# Altium project Circuits.PrjPcb
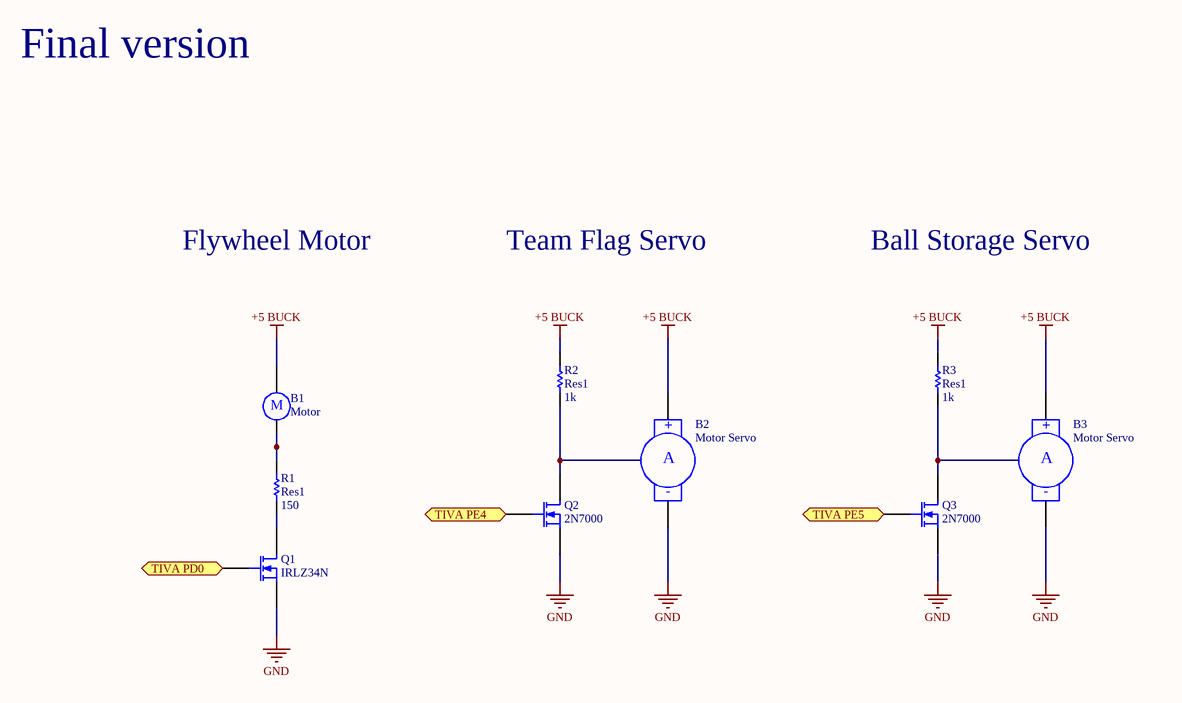
[diagram p0: Auxiliary Motors.SchDoc]
9 sheets, 120 parts. Net scope: flat (ports and power ports of the same name join across sheets).
Sheets:
  Auxiliary Motors.SchDoc
  Reloader.SchDoc
  Motor Driver.SchDoc
  Switches.SchDoc
  Misc Circuits.SchDoc
  Retroreflective Sensor.SchDoc
  Power.SchDoc
  Magnetic Sensor.SchDoc
  Beacon Sensor.SchDoc

## Sheet Auxiliary Motors.SchDoc
size A4; Organization: Altium Limited; Address1: L3, 12a Rodborough Rd; Address2: Frenchs Forest; Address3: NSW; Address4: Australia 2086

### Parts
(Parts that share a designator on the sheet are numbered #1, #2 ... from top to bottom, then left to right.)
B1#1  Motor  [RB5-10.5]
B2#1  Motor Servo  [RAD-0.4]
B3  Motor Servo  [RAD-0.4]
Q1#1  IRLZ34N  [BCY-W3/H.8]
Q2#1  2N7000  [BCY-W3/H.8]
Q3  2N7000  [BCY-W3/H.8]
R1#1  Res1  value 150  [AXIAL-0.3]
R2#1  Res1  value 1k  [AXIAL-0.3]
R3#1  Res1  value 1k  [AXIAL-0.3]

### Ports
TIVA PD0, TIVA PE4, TIVA PE5

### Nets
+5 BUCK: B1#1.1 B2#1.1(+) B3.1(+) R2#1.2 R3#1.2
GND: B2#1.2(-) B3.2(-) Q1#1.3(S) Q2#1.3(S) Q3.3(S)
NetB1#1_2: B1#1.2 R1#1.2
NetQ1#1_1: Q1#1.1(D) R1#1.1
NetQ1#1_2: Q1#1.2(G) ; port TIVA PD0
NetQ2#1_1: Q2#1.1(D) R2#1.1
NetQ2#1_2: Q2#1.2(G) ; port TIVA PE4
NetQ3_1: Q3.1(D) R3#1.1
NetQ3_2: Q3.2(G) ; port TIVA PE5

### Notes on the sheet
- Final version
- Flywheel Motor
- Team Flag Servo
- Ball Storage Servo
- Title
- Size:
- Date:
- A4
- Number:
- Time:
- Revision:
- Sheet
- of
- File:
- (in symbol Motor) M
- (in symbol Motor Servo) A

### Library data of the parts
B1#1 = Motor: Motor, General Kind; Manufacturer: Generic Components; Published: 1999
B2#1 B3 = Motor Servo: Servo Motor; Manufacturer: Generic Components; Published: 1999
Q1#1 Q2#1 Q3 = MOSFET-N: N-Channel MOSFET; Manufacturer: Generic Components; Class: Discrete; SubClass: MOSFET - Low Power; Published: 08/06/2000; Publisher: Altium Hobart Technology Centre
R1#1 R2#1 R3#1 = Res1: Resistor; Manufacturer: Generic Components; Class: Passive; Published: 08/06/2000; Publisher: Altium Hobart Technology Centre; SubClass: Resistor

## Sheet Reloader.SchDoc
size A4; Organization: Altium Limited; Address1: L3, 12a Rodborough Rd; Address2: Frenchs Forest; Address3: NSW; Address4: Australia 2086
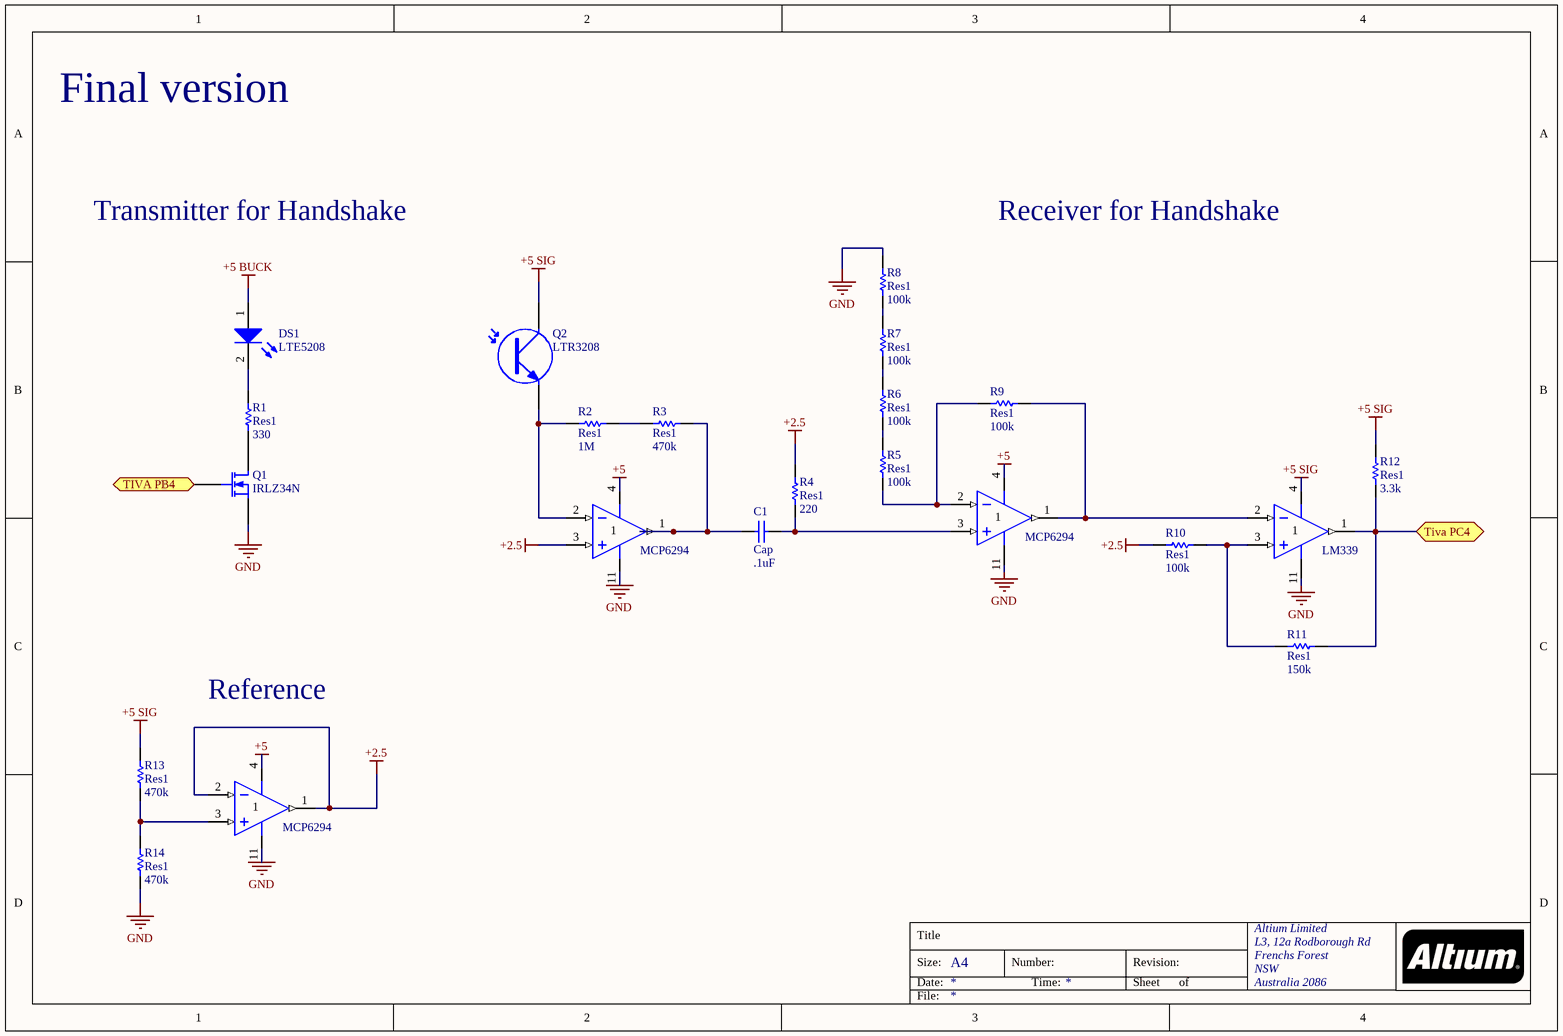
[diagram p1: Reloader.SchDoc]

### Parts
(Parts that share a designator on the sheet are numbered #1, #2 ... from top to bottom, then left to right.)
C1#1  Cap  value .1uF  [RAD-0.3]
DS1#1  LTE5208  [LED-0]
Q1#2  IRLZ34N  [BCY-W3/H.8]
Q2#2  LTR3208  [SFM-T2(3)/X1.6V]
R1#2  Res1  value 330  [AXIAL-0.3]
R2#2  Res1  value 1M  [AXIAL-0.3]
R3#2  Res1  value 470k  [AXIAL-0.3]
R4#1  Res1  value 220  [AXIAL-0.3]
R5#1  Res1  value 100k  [AXIAL-0.3]
R6#1  Res1  value 100k  [AXIAL-0.3]
R7#1  Res1  value 100k  [AXIAL-0.3]
R8#1  Res1  value 100k  [AXIAL-0.3]
R9#1  Res1  value 100k  [AXIAL-0.3]
R10#1  Res1  value 100k  [AXIAL-0.3]
R11#1  Res1  value 150k  [AXIAL-0.3]
R12#1  Res1  value 3.3k  [AXIAL-0.3]
R13#1  Res1  value 470k  [AXIAL-0.3]
R14#1  Res1  value 470k  [AXIAL-0.3]
U1#1  MCP6294  [DIP-14]  (part A of 4)
U2#1  MCP6294  [DIP-14]  (part A of 4)
U3#1  LM339  [DIP-14]  (part A of 4)
U4#1  MCP6294  [DIP-14]  (part A of 4)

### Ports
TIVA PB4, Tiva PC4

### Nets
+2.5: R4#1.2 R10#1.2 U1#1.3(IN+) U4#1.1(OUT) U4#1.2(IN-)
+5: U1#1.4(V+) U2#1.4(V+) U4#1.4(V+)
+5 BUCK: DS1#1.1(A)
+5 SIG: Q2#2.1(C) R12#1.1 R13#1.1 U3#1.4(V+)  [project net +7.2]
GND: Q1#2.3(S) R8#1.2 R14#1.2 U1#1.11(GND) U2#1.11(GND) U3#1.11(GND) U4#1.11(GND)
NetC1#1_1: C1#1.1 R3#2.2 U1#1.1(OUT)
NetC1#1_2: C1#1.2 R4#1.1 U2#1.3(IN+)
NetDS1#1_2: DS1#1.2(K) R1#2.2
NetQ1#2_1: Q1#2.1(D) R1#2.1
NetQ1#2_2: Q1#2.2(G) ; port TIVA PB4
NetQ2#2_3: Q2#2.3(E) R2#2.1 U1#1.2(IN-)
NetR2#2_2: R2#2.2 R3#2.1
NetR5#1_1: R5#1.1 R9#1.2 U2#1.2(IN-)
NetR5#1_2: R5#1.2 R6#1.1
NetR6#1_2: R6#1.2 R7#1.1
NetR7#1_2: R7#1.2 R8#1.1
NetR9#1_1: R9#1.1 U2#1.1(OUT) U3#1.2(IN-)
NetR10#1_1: R10#1.1 R11#1.2 U3#1.3(IN+)
NetR11#1_1: R11#1.1 R12#1.2 U3#1.1(OUT) ; port Tiva PC4
NetR13#1_2: R13#1.2 R14#1.1 U4#1.3(IN+)

### Notes on the sheet
- Final version
- Transmitter for Handshake
- Receiver for Handshake
- Reference
- Title
- Size:
- Date:
- A4
- Number:
- Time:
- Revision:
- Sheet
- of
- File:

### Library data of the parts
C1#1 = Cap: Capacitor; Manufacturer: Generic Components; Class: Passive; Published: 08/06/2000; Publisher: Altium Hobart Technology Centre; SubClass: Capacitor
DS1#1 = LED0: Typical INFRARED GaAs LED; Manufacturer: Generic Components; Class: Optoelectronic; Published: 08/06/2000; Publisher: Altium Hobart Technology Centre; SubClass: LED
Q1#2 = MOSFET-N: as Q1#1 on sheet Auxiliary Motors; Published: 08/06/2000; Publisher: Altium Hobart Technology Centre
Q2#2 = Photo NPN: NPN Phototransistor; Manufacturer: Generic Components; Class: Optoelectronic; Published: 1999
R1#2 R2#2 R3#2 R4#1 R5#1 R6#1 R7#1 R8#1 R9#1 R10#1 R11#1 R12#1 R13#1 R14#1 = Res1: as R1#1 on sheet Auxiliary Motors; Published: 08/06/2000; Publisher: Altium Hobart Technology Centre; SubClass: Resistor
U1#1 U2#1 U3#1 U4#1 = LM324AJ: Low-Power Quad Operational Amplifier; Manufacturer: National Semiconductor; Published: 15/04/2002; Publisher: Altium Hobart Technology Centre; Class: Amplifier; SubClass: Operational Amplifier

## Sheet Motor Driver.SchDoc
size A4; Organization: Altium Limited; Address1: L3, 12a Rodborough Rd; Address2: Frenchs Forest; Address3: NSW; Address4: Australia 2086
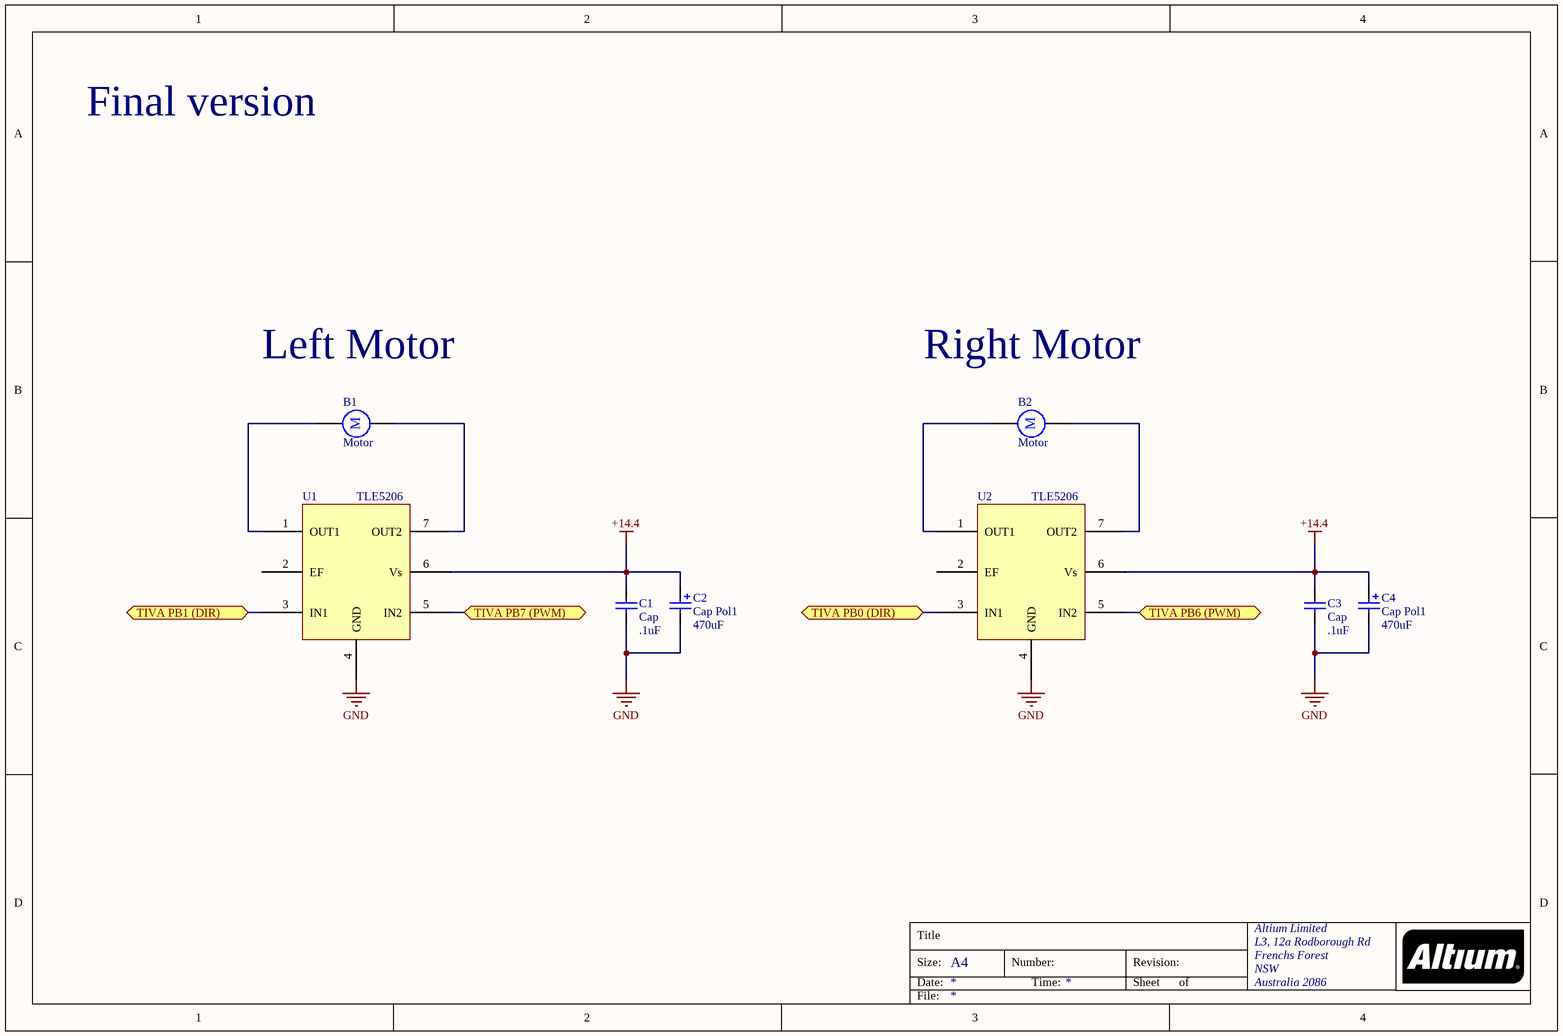
[diagram p2: Motor Driver.SchDoc]

### Parts
(Parts that share a designator on the sheet are numbered #1, #2 ... from top to bottom, then left to right.)
B1#2  Motor  [RB5-10.5]
B2#2  Motor  [RB5-10.5]
C1#2  Cap  value .1uF  [RAD-0.3]
C2#1  Cap Pol1  value 470uF  [RB7.6-15]
C3#1  Cap  value .1uF  [RAD-0.3]
C4#1  Cap Pol1  value 470uF  [RB7.6-15]
U1#2  TLE5206
U2#2  TLE5206

### Ports
TIVA PB0 (DIR), TIVA PB1 (DIR), TIVA PB6 (PWM), TIVA PB7 (PWM)

### Nets
+14.4: C1#2.2 C2#1.1 C3#1.2 C4#1.1 U1#2.6(Vs) U2#2.6(Vs)
GND: C1#2.1 C2#1.2 C3#1.1 C4#1.2 U1#2.4(GND) U2#2.4(GND)
NetB1#2_1: B1#2.1 U1#2.1(OUT1)
NetB1#2_2: B1#2.2 U1#2.7(OUT2)
NetB2#2_1: B2#2.1 U2#2.1(OUT1)
NetB2#2_2: B2#2.2 U2#2.7(OUT2)
NetU1#2_3: U1#2.3(IN1) ; port TIVA PB1 (DIR)
NetU1#2_5: U1#2.5(IN2) ; port TIVA PB7 (PWM)
NetU2#2_3: U2#2.3(IN1) ; port TIVA PB0 (DIR)
NetU2#2_5: U2#2.5(IN2) ; port TIVA PB6 (PWM)

Not connected (* = marked no-connect by the designer): U1#2 2(EF); U2#2 2(EF)

### Notes on the sheet
- Final version
- Left Motor
- Right Motor
- Title
- Size:
- Date:
- A4
- Number:
- Time:
- Revision:
- Sheet
- of
- File:
- (in symbol Motor) M

### Library data of the parts
B1#2 B2#2 = Motor: as B1#1 on sheet Auxiliary Motors; Published: 1999
C1#2 C3#1 = Cap: as C1#1 on sheet Reloader; Published: 08/06/2000; Publisher: Altium Hobart Technology Centre; SubClass: Capacitor
C2#1 C4#1 = Cap Pol1: Polarized Capacitor (Radial); Manufacturer: Generic Components; Class: Passive; Published: 08/06/2000; Publisher: Altium Hobart Technology Centre; SubClass: Capacitor

## Sheet Switches.SchDoc
size A4; Organization: Altium Limited; Address1: L3, 12a Rodborough Rd; Address2: Frenchs Forest; Address3: NSW; Address4: Australia 2086
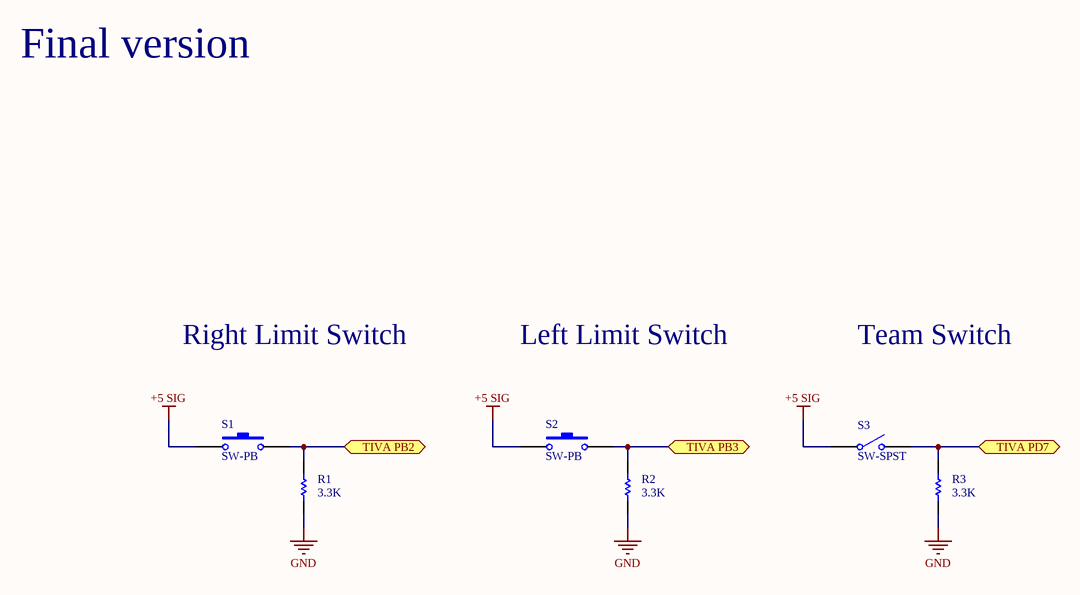
[diagram p3: Switches.SchDoc]

### Parts
(Parts that share a designator on the sheet are numbered #1, #2 ... from top to bottom, then left to right.)
R1#3  value 3.3K  [AXIAL-0.3]  (hidden comment: Res1)
R2#3  value 3.3K  [AXIAL-0.3]  (hidden comment: Res1)
R3#3  value 3.3K  [AXIAL-0.3]  (hidden comment: Res1)
S1#1  SW-PB  [SPST-2]
S2  SW-PB  [SPST-2]
S3  SW-SPST  [SPST-2]

### Ports
TIVA PB2, TIVA PB3, TIVA PD7

### Nets
+5 SIG: S1#1.1 S2.1 S3.1(COMMON)  [project net +7.2]
GND: R1#3.1 R2#3.1 R3#3.1
NetR1#3_2: R1#3.2 S1#1.2 ; port TIVA PB2
NetR2#3_2: R2#3.2 S2.2 ; port TIVA PB3
NetR3#3_2: R3#3.2 S3.2(NO) ; port TIVA PD7

### Notes on the sheet
- Final version
- Right Limit Switch
- Left Limit Switch
- Team Switch
- Title
- Size:
- Date:
- A4
- Number:
- Time:
- Revision:
- Sheet
- of
- File:

### Library data of the parts
R1#3 R2#3 R3#3 = Res1: as R1#1 on sheet Auxiliary Motors; Published: 08/06/2000; Publisher: Altium Hobart Technology Centre; SubClass: Resistor
S1#1 S2 = SW-PB: Switch; Manufacturer: Generic Components; Published: 1999
S3 = SW-SPST: Single-Pole, Single-Throw Switch; Manufacturer: Generic Components; Published: 1999

## Sheet Misc Circuits.SchDoc
size A4; Organization: Altium Limited; Address1: L3, 12a Rodborough Rd; Address2: Frenchs Forest; Address3: NSW; Address4: Australia 2086
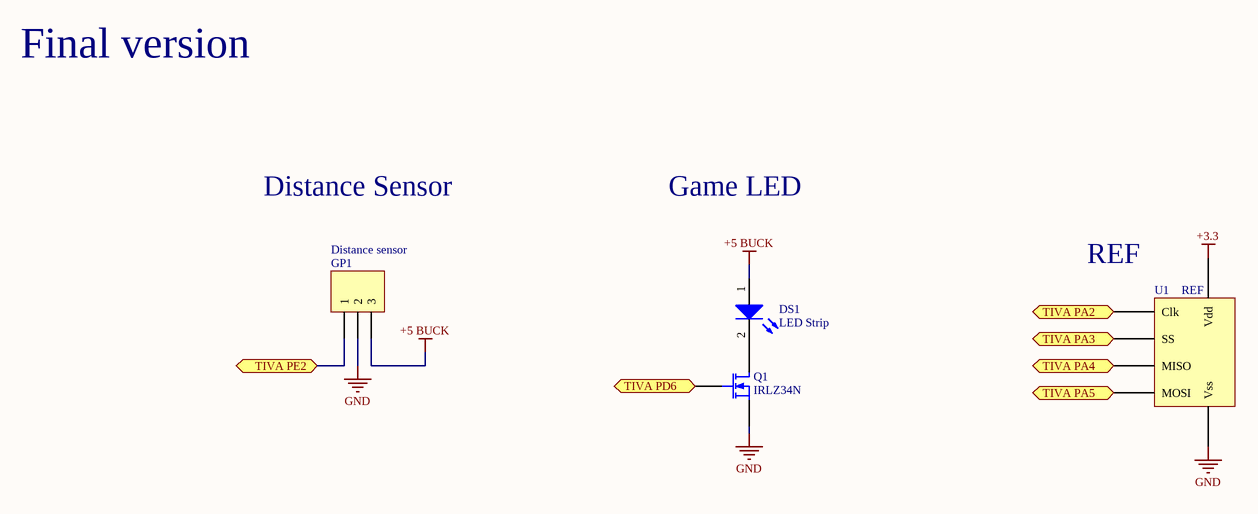
[diagram p4: Misc Circuits.SchDoc]

### Parts
(Parts that share a designator on the sheet are numbered #1, #2 ... from top to bottom, then left to right.)
DS1#2  LED Strip  [LED-0]
GP1  Distance sensor  [HDR1X3]
Q1#3  IRLZ34N  [BCY-W3/H.8]
U1#3  REF

### Ports
TIVA PA2, TIVA PA3, TIVA PA4, TIVA PA5, TIVA PD6, TIVA PE2

### Nets
+3.3: U1#3.?1(Vdd)
+5 BUCK: DS1#2.1(A) GP1.3
GND: GP1.2 Q1#3.3(S) U1#3.?2(Vss)
NetDS1#2_2: DS1#2.2(K) Q1#3.1(D)
NetGP1_1: GP1.1 ; port TIVA PE2
NetQ1#3_2: Q1#3.2(G) ; port TIVA PD6
NetU1#3_?3: U1#3.?3(Clk) ; port TIVA PA2
NetU1#3_?4: U1#3.?4(SS) ; port TIVA PA3
NetU1#3_?5: U1#3.?5(MISO) ; port TIVA PA4
NetU1#3_?6: U1#3.?6(MOSI) ; port TIVA PA5

### Notes on the sheet
- Final version
- Distance Sensor
- Game LED
- (near U1#3) REF
- Title
- Size:
- Date:
- A4
- Number:
- Time:
- Revision:
- Sheet
- of
- File:

### Library data of the parts
DS1#2 = LED0: as DS1#1 on sheet Reloader; Published: 08/06/2000; Publisher: Altium Hobart Technology Centre; SubClass: LED
GP1 = Molex3: Header, 3-Pin; Manufacturer: Generic Components; Class: Connector
Q1#3 = MOSFET-N: as Q1#1 on sheet Auxiliary Motors; Published: 08/06/2000; Publisher: Altium Hobart Technology Centre

## Sheet Retroreflective Sensor.SchDoc
size A4; Organization: Altium Limited; Address1: L3, 12a Rodborough Rd; Address2: Frenchs Forest; Address3: NSW; Address4: Australia 2086
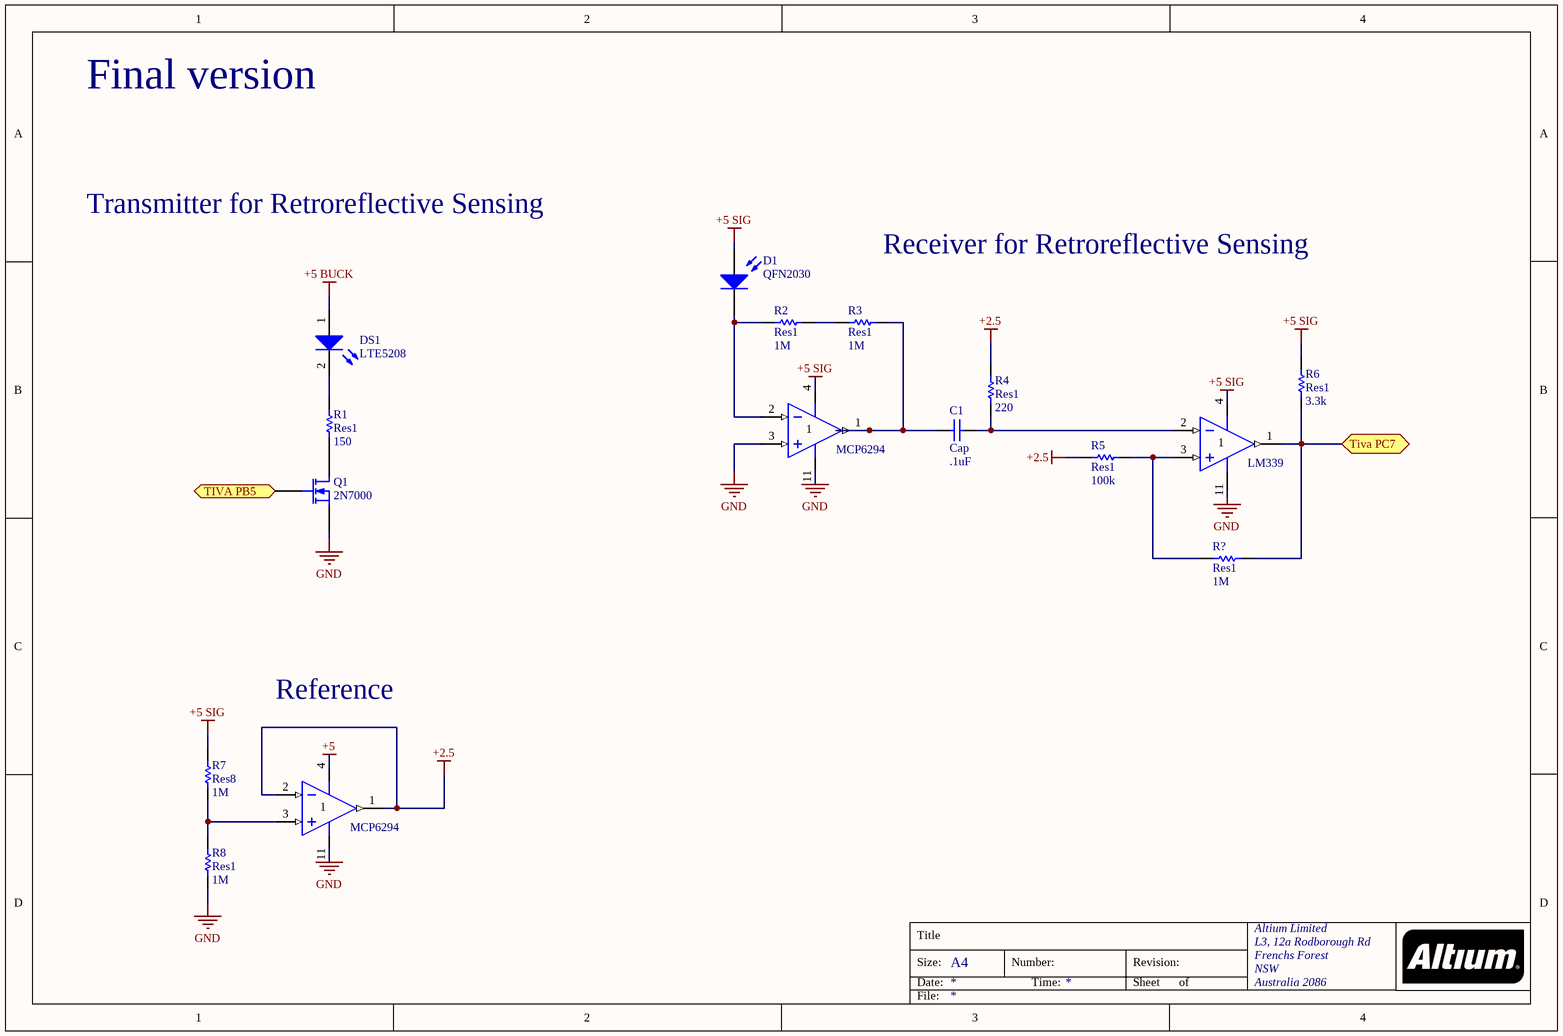
[diagram p5: Retroreflective Sensor.SchDoc]

### Parts
(Parts that share a designator on the sheet are numbered #1, #2 ... from top to bottom, then left to right.)
C1#3  Cap  value .1uF  [RAD-0.3]
D1#1  QFN2030  [PIN2]
DS1#3  LTE5208  [LED-0]
Q1#4  2N7000  [BCY-W3/H.8]
R1#4  Res1  value 150  [AXIAL-0.3]
R2#4  Res1  value 1M  [AXIAL-0.3]
R3#4  Res1  value 1M  [AXIAL-0.3]
R4#2  Res1  value 220  [AXIAL-0.3]
R5#2  Res1  value 100k  [AXIAL-0.3]
R6#2  Res1  value 3.3k  [AXIAL-0.3]
R7#2  Res8  value 1M  [AXIAL-0.3]
R8#2  Res1  value 1M  [AXIAL-0.3]
R?  Res1  value 1M  [AXIAL-0.3]
U1#4  MCP6294  [DIP-14]  (part A of 4)
U2#3  LM339  [DIP-14]  (part A of 4)
U3#2  MCP6294  [DIP-14]  (part A of 4)

### Ports
TIVA PB5, Tiva PC7

### Nets
+2.5: R4#2.2 R5#2.2 U3#2.1(OUT) U3#2.2(IN-)
+5: U3#2.4(V+)
+5 BUCK: DS1#3.1(A)
+5 SIG: D1#1.1(A) R6#2.1 R7#2.1 U1#4.4(V+) U2#3.4(V+)  [project net +7.2]
GND: Q1#4.3(S) R8#2.2 U1#4.3(IN+) U1#4.11(GND) U2#3.11(GND) U3#2.11(GND)
NetC1#3_1: C1#3.1 R3#4.2 U1#4.1(OUT)
NetC1#3_2: C1#3.2 R4#2.1 U2#3.2(IN-)
NetD1#1_2: D1#1.2(K) R2#4.1 U1#4.2(IN-)
NetDS1#3_2: DS1#3.2(K) R1#4.2
NetQ1#4_1: Q1#4.1(D) R1#4.1
NetQ1#4_2: Q1#4.2(G) ; port TIVA PB5
NetR2#4_2: R2#4.2 R3#4.1
NetR5#2_1: R5#2.1 R?.2 U2#3.3(IN+)
NetR6#2_2: R6#2.2 R?.1 U2#3.1(OUT) ; port Tiva PC7
NetR7#2_2: R7#2.2 R8#2.1 U3#2.3(IN+)

### Notes on the sheet
- Final version
- Transmitter for Retroreflective Sensing
- Receiver for Retroreflective Sensing
- Reference
- Title
- Size:
- Date:
- A4
- Number:
- Time:
- Revision:
- Sheet
- of
- File:

### Library data of the parts
C1#3 = Cap: as C1#1 on sheet Reloader; Published: 08/06/2000; Publisher: Altium Hobart Technology Centre; SubClass: Capacitor
D1#1 = Photo Sen: Photosensitive Diode; Manufacturer: Generic Components; Class: Optoelectronic; Published: 1999
DS1#3 = LED0: as DS1#1 on sheet Reloader; Published: 08/06/2000; Publisher: Altium Hobart Technology Centre; SubClass: LED
Q1#4 = MOSFET-N: as Q1#1 on sheet Auxiliary Motors; Published: 08/06/2000; Publisher: Altium Hobart Technology Centre
R1#4 R2#4 R3#4 R4#2 R5#2 R6#2 R7#2 R8#2 R? = Res1: as R1#1 on sheet Auxiliary Motors; Published: 08/06/2000; Publisher: Altium Hobart Technology Centre; SubClass: Resistor
U1#4 U2#3 U3#2 = LM324AJ: as U1#1 on sheet Reloader; Published: 15/04/2002; Publisher: Altium Hobart Technology Centre; Class: Amplifier; SubClass: Operational Amplifier

## Sheet Power.SchDoc
size A4; Organization: Altium Limited; Address1: L3, 12a Rodborough Rd; Address2: Frenchs Forest; Address3: NSW; Address4: Australia 2086
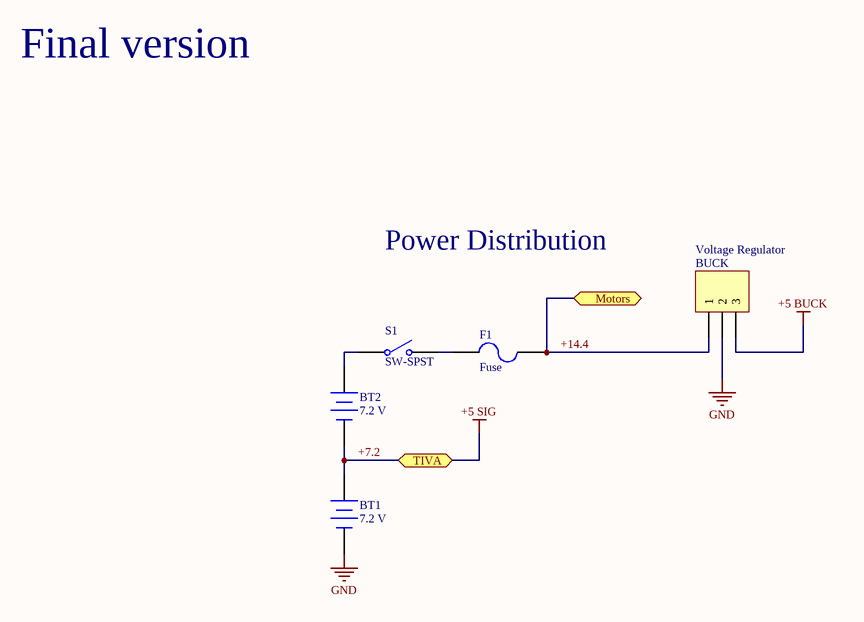
[diagram p6: Power.SchDoc]

### Parts
(Parts that share a designator on the sheet are numbered #1, #2 ... from top to bottom, then left to right.)
BT1  7.2 V  [BAT-2]
BT2  7.2 V  [BAT-2]
BUCK  Voltage Regulator  [HDR1X3]
F1  Fuse  [PIN-W2/E2.8]
S1#2  SW-SPST  [SPST-2]

### Ports
Motors, TIVA

### Nets
+5 BUCK: BUCK.3
+7.2: BT1.1(+) BT2.2(-) ; port TIVA  [also labelled +5 SIG]
GND: BT1.2(-) BUCK.2
+14.4: BUCK.1 F1.2 ; port Motors
NetBT2_1: BT2.1(+) S1#2.1(COMMON)
NetF1_1: F1.1 S1#2.2(NO)

### Notes on the sheet
- Final version
- Power Distribution
- Title
- Size:
- Date:
- A4
- Number:
- Time:
- Revision:
- Sheet
- of
- File:

### Library data of the parts
BT1 BT2 = Battery: Multicell Battery; Manufacturer: Generic Components; Published: 1999
BUCK = Molex3: as GP1 on sheet Misc Circuits
F1 = Fuse 2: Manufacturer: Generic Components; Class: Passive; Published: 08/06/2000; Publisher: Altium Hobart Technology Centre; SubClass: Fuse
S1#2 = SW-SPST: as S3 on sheet Switches; Published: 1999

## Sheet Magnetic Sensor.SchDoc
size A4; Organization: Altium Limited; Address1: L3, 12a Rodborough Rd; Address2: Frenchs Forest; Address3: NSW; Address4: Australia 2086
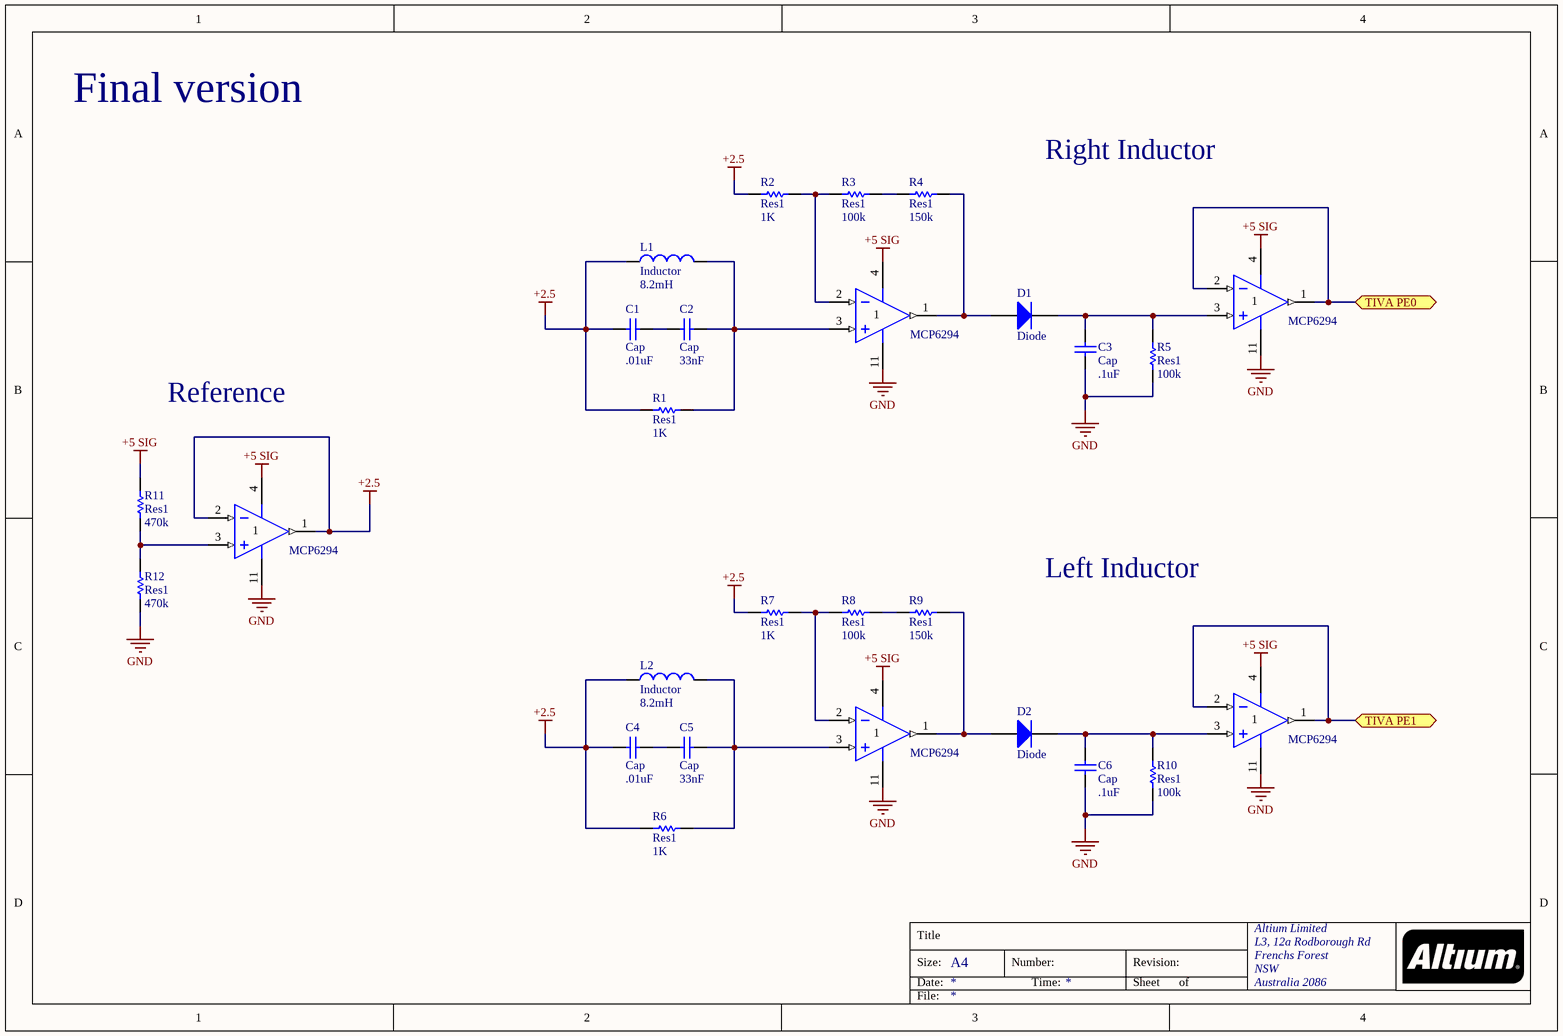
[diagram p7: Magnetic Sensor.SchDoc]

### Parts
(Parts that share a designator on the sheet are numbered #1, #2 ... from top to bottom, then left to right.)
C1#4  Cap  value .01uF  [RAD-0.3]
C2#2  Cap  value 33nF  [RAD-0.3]
C3#2  Cap  value .1uF  [RAD-0.3]
C4#2  Cap  value .01uF  [RAD-0.3]
C5  Cap  value 33nF  [RAD-0.3]
C6  Cap  value .1uF  [RAD-0.3]
D1#2  Diode  [DSO-C2/X3.3]
D2#1  Diode  [DSO-C2/X3.3]
L1  Inductor  value 8.2mH  [C1005-0402]
L2  Inductor  value 8.2mH  [C1005-0402]
R1#5  Res1  value 1K  [AXIAL-0.3]
R2#5  Res1  value 1K  [AXIAL-0.3]
R3#5  Res1  value 100k  [AXIAL-0.3]
R4#3  Res1  value 150k  [AXIAL-0.3]
R5#3  Res1  value 100k  [AXIAL-0.3]
R6#3  Res1  value 1K  [AXIAL-0.3]
R7#3  Res1  value 1K  [AXIAL-0.3]
R8#3  Res1  value 100k  [AXIAL-0.3]
R9#2  Res1  value 150k  [AXIAL-0.3]
R10#2  Res1  value 100k  [AXIAL-0.3]
R11#2  Res1  value 470k  [AXIAL-0.3]
R12#2  Res1  value 470k  [AXIAL-0.3]
U1#5  MCP6294  [DIP-14/D19.7]  (part A of 4)
U2#4  MCP6294  [DIP-14/D19.7]  (part A of 4)
U3#3  MCP6294  [DIP-14/D19.7]  (part A of 4)
U4#2  MCP6294  [DIP-14/D19.7]  (part A of 4)
U5#1  MCP6294  [DIP-14/D19.7]  (part A of 4)

### Ports
TIVA PE0, TIVA PE1

### Nets
+2.5: C1#4.1 C4#2.1 L1.1 L2.1 R1#5.1 R2#5.1 R6#3.1 R7#3.1 U5#1.1(OUT) U5#1.2(IN-)
+5 SIG: R11#2.2 U1#5.4(V+) U2#4.4(V+) U3#3.4(V+) U4#2.4(V+) U5#1.4(V+)  [project net +7.2]
GND: C3#2.1 C6.1 R5#3.1 R10#2.1 R12#2.1 U1#5.11(V-) U2#4.11(V-) U3#3.11(V-) U4#2.11(V-) U5#1.11(V-)
NetC1#4_2: C1#4.2 C2#2.1
NetC2#2_2: C2#2.2 L1.2 R1#5.2 U1#5.3(IN+)
NetC3#2_2: C3#2.2 D1#2.2(K) R5#3.2 U2#4.3(IN+)
NetC4#2_2: C4#2.2 C5.1
NetC5_2: C5.2 L2.2 R6#3.2 U3#3.3(IN+)
NetC6_2: C6.2 D2#1.2(K) R10#2.2 U4#2.3(IN+)
NetD1#2_1: D1#2.1(A) R4#3.2 U1#5.1(OUT)
NetD2#1_1: D2#1.1(A) R9#2.2 U3#3.1(OUT)
NetR2#5_2: R2#5.2 R3#5.1 U1#5.2(IN-)
NetR3#5_2: R3#5.2 R4#3.1
NetR7#3_2: R7#3.2 R8#3.1 U3#3.2(IN-)
NetR8#3_2: R8#3.2 R9#2.1
NetR11#2_1: R11#2.1 R12#2.2 U5#1.3(IN+)
NetU2#4_1: U2#4.1(OUT) U2#4.2(IN-) ; port TIVA PE0
NetU4#2_1: U4#2.1(OUT) U4#2.2(IN-) ; port TIVA PE1

### Notes on the sheet
- Final version
- Right Inductor
- Reference
- Left Inductor
- Title
- Size:
- Date:
- A4
- Number:
- Time:
- Revision:
- Sheet
- of
- File:

### Library data of the parts
C1#4 C2#2 C3#2 C4#2 C5 C6 = Cap: as C1#1 on sheet Reloader; Published: 08/06/2000; Publisher: Altium Hobart Technology Centre; SubClass: Capacitor
D1#2 D2#1 = Diode: Default Diode; Manufacturer: Generic Components; Class: Discrete; SubClass: Diode - Switching; Published: 08/06/2000; Publisher: Altium Hobart Technology Centre
L1 L2 = Inductor: Manufacturer: Generic Components; Class: Passive; Published: 08/06/2000; Publisher: Altium Hobart Technology Centre; SubClass: Inductor
R1#5 R2#5 R3#5 R4#3 R5#3 R6#3 R7#3 R8#3 R9#2 R10#2 R11#2 R12#2 = Res1: as R1#1 on sheet Auxiliary Motors; Published: 08/06/2000; Publisher: Altium Hobart Technology Centre; SubClass: Resistor
U1#5 U2#4 U3#3 U4#2 U5#1 = LM6144BIN: High-Speed/Low-Power 17MHz Rail-to-Rail, Input-Output Operational Amplifier; Manufacturer: National Semiconductor; Published: 15/04/2002; Publisher: Altium Hobart Technology Centre; Class: Amplifier; SubClass: Operational Amplifier

## Sheet Beacon Sensor.SchDoc
size A4; Organization: Altium Limited; Address1: L3, 12a Rodborough Rd; Address2: Frenchs Forest; Address3: NSW; Address4: Australia 2086
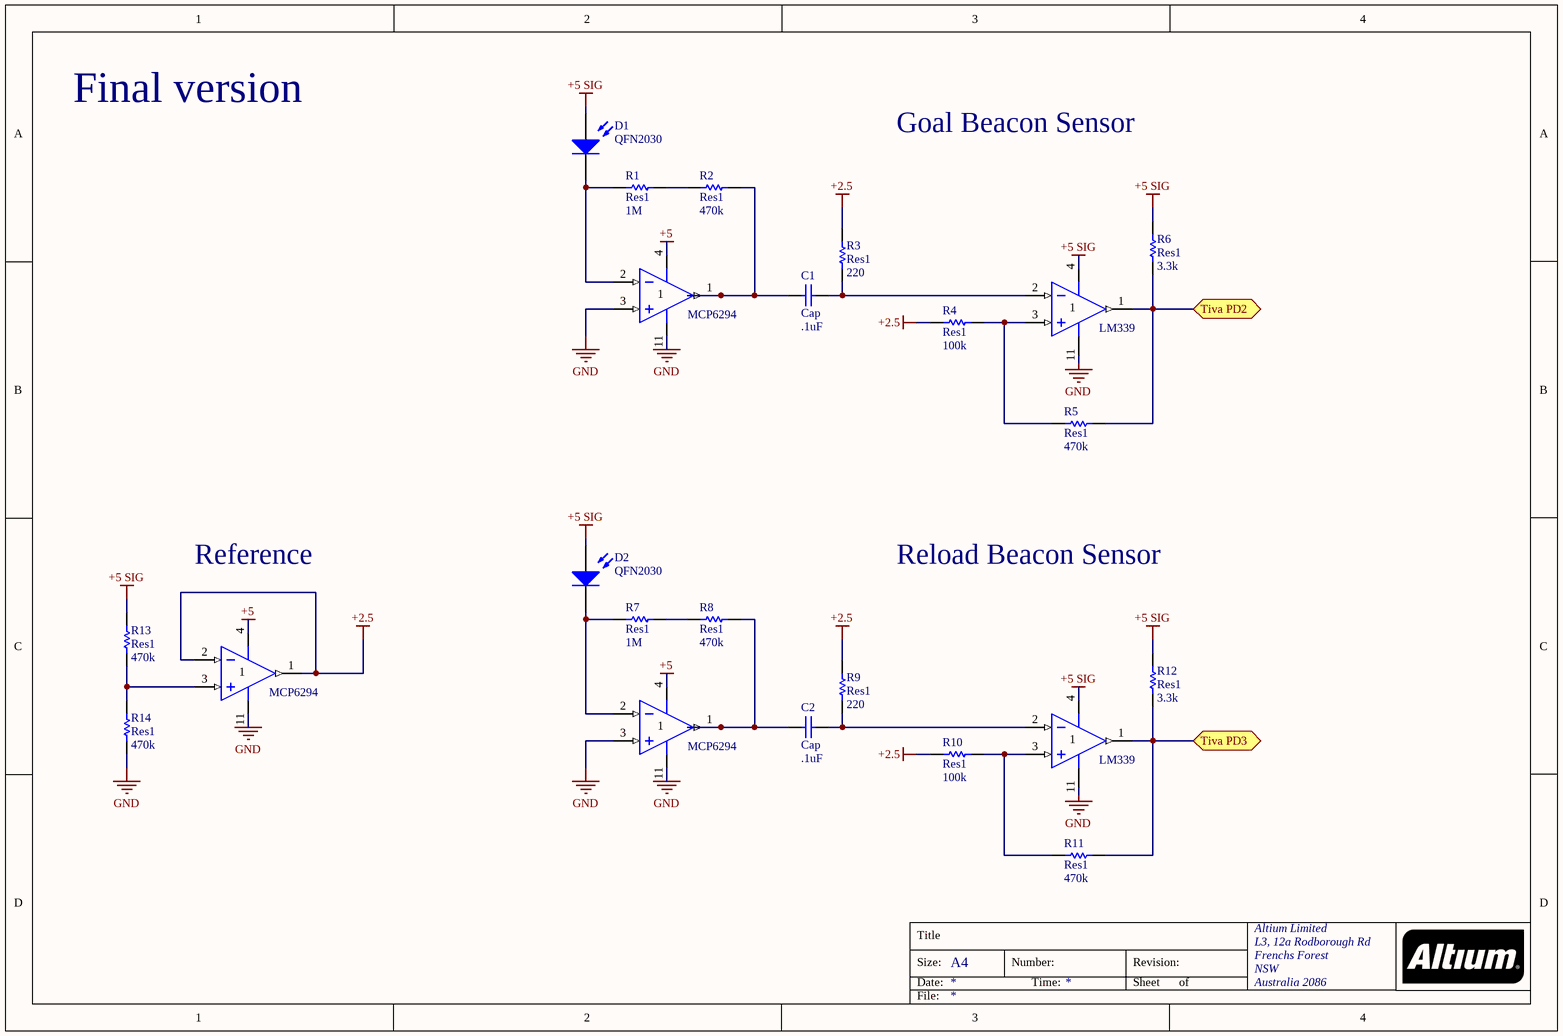
[diagram p8: Beacon Sensor.SchDoc]

### Parts
(Parts that share a designator on the sheet are numbered #1, #2 ... from top to bottom, then left to right.)
C1#5  Cap  value .1uF  [RAD-0.3]
C2#3  Cap  value .1uF  [RAD-0.3]
D1#3  QFN2030  [PIN2]
D2#2  QFN2030  [PIN2]
R1#6  Res1  value 1M  [AXIAL-0.3]
R2#6  Res1  value 470k  [AXIAL-0.3]
R3#6  Res1  value 220  [AXIAL-0.3]
R4#4  Res1  value 100k  [AXIAL-0.3]
R5#4  Res1  value 470k  [AXIAL-0.3]
R6#4  Res1  value 3.3k  [AXIAL-0.3]
R7#4  Res1  value 1M  [AXIAL-0.3]
R8#4  Res1  value 470k  [AXIAL-0.3]
R9#3  Res1  value 220  [AXIAL-0.3]
R10#3  Res1  value 100k  [AXIAL-0.3]
R11#3  Res1  value 470k  [AXIAL-0.3]
R12#3  Res1  value 3.3k  [AXIAL-0.3]
R13#2  Res1  value 470k  [AXIAL-0.3]
R14#2  Res1  value 470k  [AXIAL-0.3]
U1#6  MCP6294  [DIP-14]  (part A of 4)
U2#5  LM339  [DIP-14]  (part A of 4)
U3#4  MCP6294  [DIP-14]  (part A of 4)
U4#3  LM339  [DIP-14]  (part A of 4)
U5#2  MCP6294  [DIP-14]  (part A of 4)

### Ports
Tiva PD2, Tiva PD3

### Nets
+2.5: R3#6.2 R4#4.2 R9#3.2 R10#3.2 U5#2.1(OUT) U5#2.2(IN-)
+5: U1#6.4(V+) U3#4.4(V+) U5#2.4(V+)
+5 SIG: D1#3.1(A) D2#2.1(A) R6#4.1 R12#3.1 R13#2.1 U2#5.4(V+) U4#3.4(V+)  [project net +7.2]
GND: R14#2.2 U1#6.3(IN+) U1#6.11(GND) U2#5.11(GND) U3#4.3(IN+) U3#4.11(GND) U4#3.11(GND) U5#2.11(GND)
NetC1#5_1: C1#5.1 R2#6.2 U1#6.1(OUT)
NetC1#5_2: C1#5.2 R3#6.1 U2#5.2(IN-)
NetC2#3_1: C2#3.1 R8#4.2 U3#4.1(OUT)
NetC2#3_2: C2#3.2 R9#3.1 U4#3.2(IN-)
NetD1#3_2: D1#3.2(K) R1#6.1 U1#6.2(IN-)
NetD2#2_2: D2#2.2(K) R7#4.1 U3#4.2(IN-)
NetR1#6_2: R1#6.2 R2#6.1
NetR4#4_1: R4#4.1 R5#4.2 U2#5.3(IN+)
NetR5#4_1: R5#4.1 R6#4.2 U2#5.1(OUT) ; port Tiva PD2
NetR7#4_2: R7#4.2 R8#4.1
NetR10#3_1: R10#3.1 R11#3.2 U4#3.3(IN+)
NetR11#3_1: R11#3.1 R12#3.2 U4#3.1(OUT) ; port Tiva PD3
NetR13#2_2: R13#2.2 R14#2.1 U5#2.3(IN+)

### Notes on the sheet
- Final version
- Goal Beacon Sensor
- Reference
- Reload Beacon Sensor
- Title
- Size:
- Date:
- A4
- Number:
- Time:
- Revision:
- Sheet
- of
- File:

### Library data of the parts
C1#5 C2#3 = Cap: as C1#1 on sheet Reloader; Published: 08/06/2000; Publisher: Altium Hobart Technology Centre; SubClass: Capacitor
D1#3 D2#2 = Photo Sen: as D1#1 on sheet Retroreflective Sensor; Published: 1999
R1#6 R2#6 R3#6 R4#4 R5#4 R6#4 R7#4 R8#4 R9#3 R10#3 R11#3 R12#3 R13#2 R14#2 = Res1: as R1#1 on sheet Auxiliary Motors; Published: 08/06/2000; Publisher: Altium Hobart Technology Centre; SubClass: Resistor
U1#6 U2#5 U3#4 U4#3 U5#2 = LM324AJ: as U1#1 on sheet Reloader; Published: 15/04/2002; Publisher: Altium Hobart Technology Centre; Class: Amplifier; SubClass: Operational Amplifier

## Nets that join several sheets
+2.5: Reloader (5 pins), Retroreflective Sensor (R4#2.2 R5#2.2 U3#2.1 U3#2.2), Magnetic Sensor (10 pins), Beacon Sensor (6 pins)
+5: Reloader (U1#1.4 U2#1.4 U4#1.4), Retroreflective Sensor (U3#2.4), Beacon Sensor (U1#6.4 U3#4.4 U5#2.4)
+5 BUCK: Auxiliary Motors (5 pins), Reloader (DS1#1.1), Misc Circuits (DS1#2.1 GP1.3), Retroreflective Sensor (DS1#3.1), Power (BUCK.3)
+7.2: Reloader (Q2#2.1 R12#1.1 R13#1.1 U3#1.4), Switches (S1#1.1 S2.1 S3.1), Retroreflective Sensor (5 pins), Power (BT1.1 BT2.2), Magnetic Sensor (6 pins), Beacon Sensor (7 pins)
GND: Auxiliary Motors (5 pins), Reloader (7 pins), Motor Driver (6 pins), Switches (R1#3.1 R2#3.1 R3#3.1), Misc Circuits (GP1.2 Q1#3.3 U1#3.?2), Retroreflective Sensor (6 pins), Power (BT1.2 BUCK.2), Magnetic Sensor (10 pins), Beacon Sensor (8 pins)